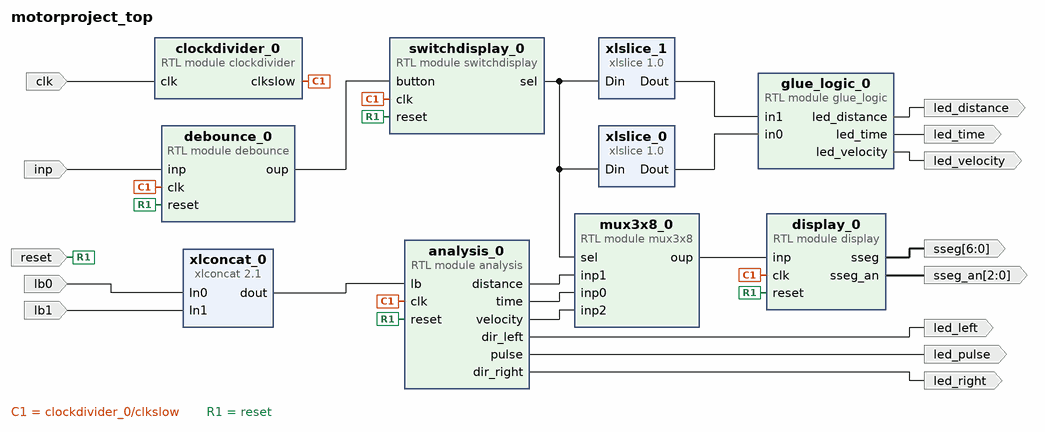
[diagram p0: block diagram of the top level]
# Vivado block design motorproject_top, xc7vx485tffg1157-1, Vivado 2022.2
create_bd_design motorproject_top

create_bd_port -dir O -from 6 -to 0 sseg
create_bd_port -dir O -from 2 -to 0 sseg_an
create_bd_port -dir O led_time
create_bd_port -dir O led_distance
create_bd_port -dir O led_velocity
create_bd_port -dir I -type clk clk
set_property -dict {CONFIG.FREQ_HZ 100000000} [get_bd_ports clk]
create_bd_port -dir I inp
create_bd_port -dir I reset
create_bd_port -dir I lb0
create_bd_port -dir I lb1
create_bd_port -dir O led_left
create_bd_port -dir O led_right
create_bd_port -dir O led_pulse

create_bd_cell -type module -reference analysis analysis_0
create_bd_cell -type module -reference debounce debounce_0
create_bd_cell -type module -reference clockdivider clockdivider_0
create_bd_cell -type module -reference switchdisplay switchdisplay_0
create_bd_cell -type module -reference glue_logic glue_logic_0
create_bd_cell -type module -reference mux3x8 mux3x8_0
create_bd_cell -type module -reference display display_0
create_bd_cell -type ip -vlnv xilinx.com:ip:xlconcat:2.1 xlconcat_0
create_bd_cell -type ip -vlnv xilinx.com:ip:xlslice:1.0 xlslice_0
set_property -dict {CONFIG.DIN_WIDTH 2} [get_bd_cells xlslice_0]
create_bd_cell -type ip -vlnv xilinx.com:ip:xlslice:1.0 xlslice_1
set_property -dict {CONFIG.DIN_FROM 1 CONFIG.DIN_TO 1 CONFIG.DIN_WIDTH 2 CONFIG.DOUT_WIDTH 1} [get_bd_cells xlslice_1]

# ---- connections ----

connect_bd_net [get_bd_pins clockdivider_0/clkslow] \
  [get_bd_pins analysis_0/clk] [get_bd_pins debounce_0/clk] [get_bd_pins switchdisplay_0/clk] [get_bd_pins display_0/clk]
connect_bd_net [get_bd_ports reset] \
  [get_bd_pins analysis_0/reset] [get_bd_pins debounce_0/reset] [get_bd_pins switchdisplay_0/reset] \
  [get_bd_pins display_0/reset]
connect_bd_net [get_bd_pins analysis_0/dir_left] [get_bd_ports led_left]
connect_bd_net [get_bd_pins analysis_0/dir_right] [get_bd_ports led_right]
connect_bd_net [get_bd_pins analysis_0/distance] [get_bd_pins mux3x8_0/inp1]
connect_bd_net [get_bd_pins analysis_0/pulse] [get_bd_ports led_pulse]
connect_bd_net [get_bd_pins analysis_0/time] [get_bd_pins mux3x8_0/inp0]
connect_bd_net [get_bd_pins analysis_0/velocity] [get_bd_pins mux3x8_0/inp2]
connect_bd_net [get_bd_ports clk] [get_bd_pins clockdivider_0/clk]
connect_bd_net [get_bd_pins debounce_0/oup] [get_bd_pins switchdisplay_0/button]
connect_bd_net [get_bd_pins display_0/sseg] [get_bd_ports sseg]
connect_bd_net [get_bd_pins display_0/sseg_an] [get_bd_ports sseg_an]
connect_bd_net [get_bd_pins glue_logic_0/led_distance] [get_bd_ports led_distance]
connect_bd_net [get_bd_pins glue_logic_0/led_time] [get_bd_ports led_time]
connect_bd_net [get_bd_pins glue_logic_0/led_velocity] [get_bd_ports led_velocity]
connect_bd_net [get_bd_ports inp] [get_bd_pins debounce_0/inp]
connect_bd_net -net lb0_1 [get_bd_ports lb0] [get_bd_pins xlconcat_0/In0]
connect_bd_net -net lb1_1 [get_bd_ports lb1] [get_bd_pins xlconcat_0/In1]
connect_bd_net [get_bd_pins mux3x8_0/oup] [get_bd_pins display_0/inp]
connect_bd_net [get_bd_pins switchdisplay_0/sel] [get_bd_pins mux3x8_0/sel] [get_bd_pins xlslice_0/Din] [get_bd_pins xlslice_1/Din]
connect_bd_net [get_bd_pins xlconcat_0/dout] [get_bd_pins analysis_0/lb]
connect_bd_net [get_bd_pins xlslice_0/Dout] [get_bd_pins glue_logic_0/in0]
connect_bd_net [get_bd_pins xlslice_1/Dout] [get_bd_pins glue_logic_0/in1]

validate_bd_design
save_bd_design
